# Altium schematic sheet CM3_HDMI.SchDoc
size A4; DocumentNumber: 2; SheetNumber: 2; SheetTotal: 4; SheetTitle: CM3_HDMI.SchDoc
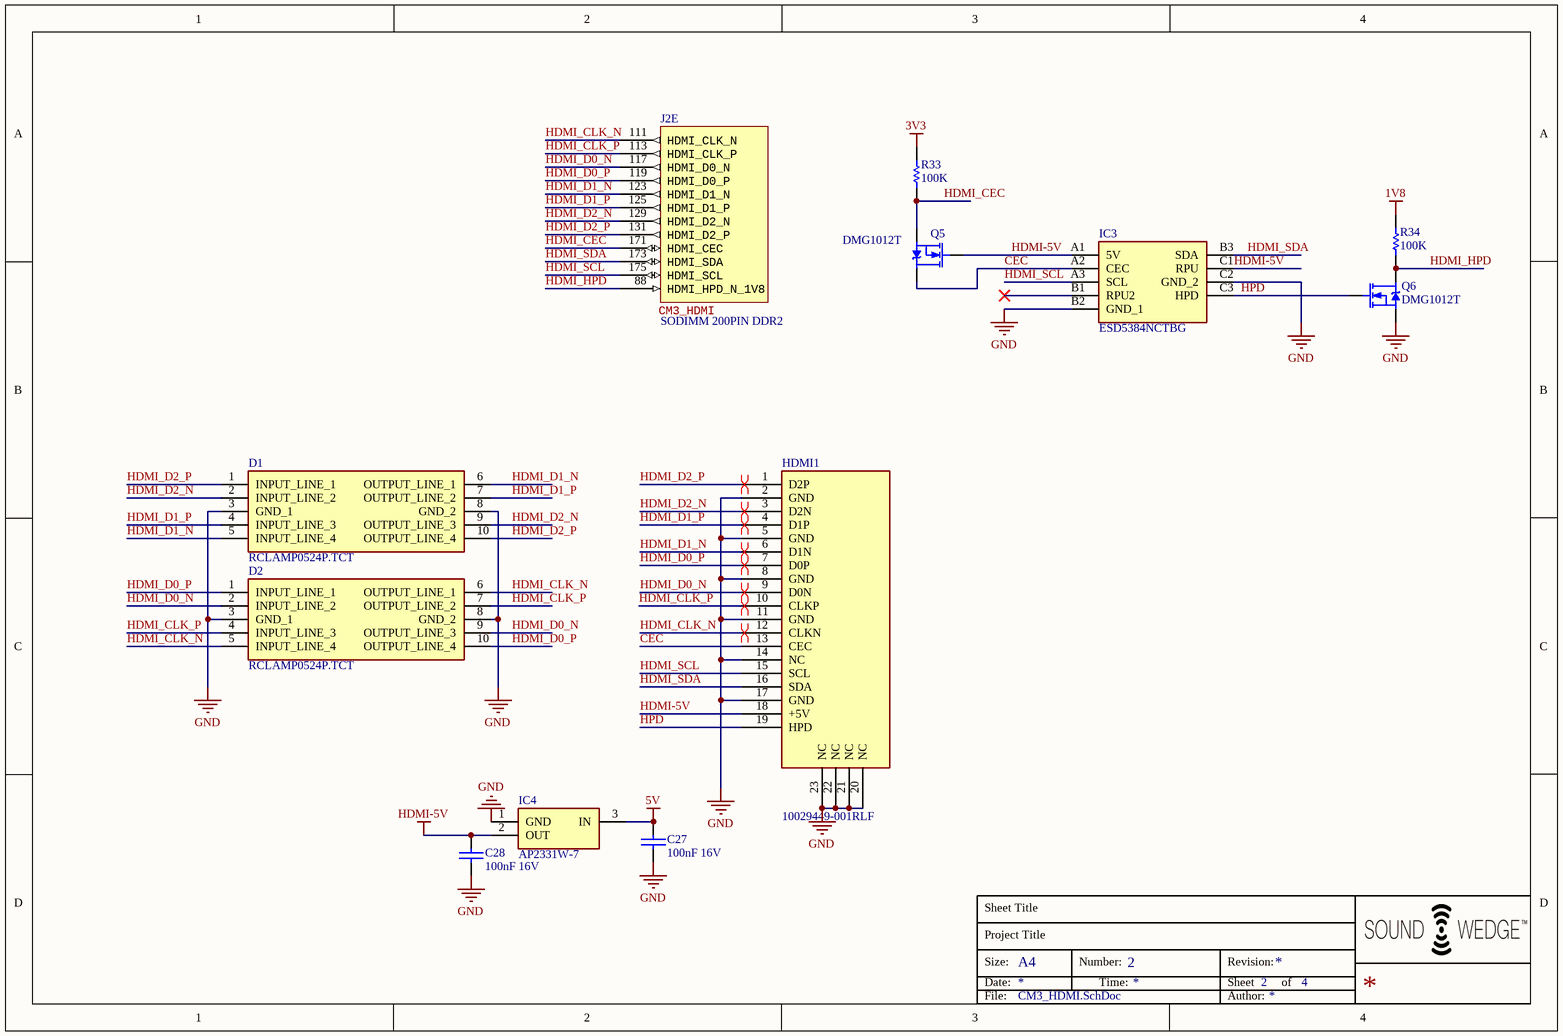
[diagram p0: CM3_HDMI.SchDoc]

## Parts
C27  100nF 16V  [0402C]
C28  100nF 16V  [0402C]
D1  RCLAMP0524P.TCT  [RCLAMP0524P]
D2  RCLAMP0524P.TCT  [RCLAMP0524P]
HDMI1  10029449-001RLF  [HDMI-001]
IC3  ESD5384NCTBG  [BGA9C40P3X3_114X114X63]
IC4  AP2331W-7  [SOT95P285X130-3N]
J2  SODIMM 200PIN DDR2  [SODIMM 200PIN - 5.2H]  (part E of 13)
Q5  DMG1012T  [SOT523]
Q6  DMG1012T  [SOT523]
R33  100K  [0402R]
R34  100K  [0402R]

## Nets
1V8: R34.2
3V3: R33.2
5V: C27.1 IC4.3(IN)
GND: C27.2 C28.2 D1.3(GND_1) D1.8(GND_2) D2.3(GND_1) D2.8(GND_2) HDMI1.2(GND) HDMI1.5(GND) HDMI1.8(GND) HDMI1.11(GND) HDMI1.14(NC) HDMI1.17(GND) HDMI1.20(NC) HDMI1.21(NC) HDMI1.22(NC) HDMI1.23(NC) IC3.B2(GND_1) IC3.C2(GND_2) IC4.1(GND) Q6.S
HDMI-5V: C28.1 HDMI1.18(+5V) IC3.A1(5V) IC3.C1(RPU) IC4.2(OUT) Q5.G
CEC: HDMI1.13(CEC) IC3.A2(CEC) Q5.D
HDMI_CEC: J2.171(HDMI_CEC) Q5.S R33.1
HDMI_CLK_N: D2.5(INPUT_LINE_4) D2.6(OUTPUT_LINE_1) HDMI1.12(CLKN) J2.111(HDMI_CLK_N)
HDMI_CLK_P: D2.4(INPUT_LINE_3) D2.7(OUTPUT_LINE_2) HDMI1.10(CLKP) J2.113(HDMI_CLK_P)
HDMI_D0_N: D2.2(INPUT_LINE_2) D2.9(OUTPUT_LINE_3) HDMI1.9(D0N) J2.117(HDMI_D0_N)
HDMI_D0_P: D2.1(INPUT_LINE_1) D2.10(OUTPUT_LINE_4) HDMI1.7(D0P) J2.119(HDMI_D0_P)
HDMI_D1_N: D1.5(INPUT_LINE_4) D1.6(OUTPUT_LINE_1) HDMI1.6(D1N) J2.123(HDMI_D1_N)
HDMI_D1_P: D1.4(INPUT_LINE_3) D1.7(OUTPUT_LINE_2) HDMI1.4(D1P) J2.125(HDMI_D1_P)
HDMI_D2_N: D1.2(INPUT_LINE_2) D1.9(OUTPUT_LINE_3) HDMI1.3(D2N) J2.129(HDMI_D2_N)
HDMI_D2_P: D1.1(INPUT_LINE_1) D1.10(OUTPUT_LINE_4) HDMI1.1(D2P) J2.131(HDMI_D2_P)
HDMI_HPD: J2.88(HDMI_HPD_N_1V8) Q6.D R34.1
HDMI_SCL: HDMI1.15(SCL) IC3.A3(SCL) J2.175(HDMI_SCL)
HDMI_SDA: HDMI1.16(SDA) IC3.B3(SDA) J2.173(HDMI_SDA)
HPD: HDMI1.19(HPD) IC3.C3(HPD) Q6.G

Not connected (* = marked no-connect by the designer): IC3 B1(RPU2)*

## Layout directives
differential pair: HDMI_CLK_N, HDMI_CLK_P, HDMI_D0_N, HDMI_D0_P, HDMI_D1_N, HDMI_D1_P, HDMI_D2_N, HDMI_D2_P

## Notes on the sheet
- Sheet Title
- Project Title
- Size:
- Date:
- A4
- Number:
- Time:
- Revision:
- Sheet
- of
- File:
- Author:
- (in symbol RPi-CM3, part E) CM3_HDMI

## Library data of the parts
C27 C28 = CAP
D1 D2 = RCLAMP0524P.TCT: Diode; Manufacturer_Name: SEMTECH; Datasheet Link: http://www.semtech.com/images/datasheet/rclamp0522p_0524p.pdf; Manufacturer_Part_Number: RCLAMP0524P.TCT; Arrow Part Number: RCLAMP0524P.TCT; Arrow Price/Stock: https://www.arrow.com/en/products/rclamp0524p.tct/semtech; Mouser Part Number: 947-RCLAMP0524P.TCT; Mouser Price/Stock: https://www.mouser.co.uk/ProductDetail/Semtech/RCLAMP0524PTCT?qs=rBWM4%252BvDhIdgSxIzr%252B4z8Q%3D%3D
HDMI1 = 10029449-001RLF: HDMI Connector; Manufacturer_Name: Amphenol; Allied_Number: 70247646; Datasheet Link: https://cdn.amphenol-icc.com/media/wysiwyg/files/drawing/10029449.pdf; Height: 6.3mm; Manufacturer_Part_Number: 10029449-001RLF; Mouser Part Number: 649-10029449-001RLF; Mouser Price/Stock: https://www.mouser.com/Search/Refine.aspx?Keyword=649-10029449-001RLF; RS Part Number: 7710094; RS Price/Stock: http://uk.rs-online.com/web/p/products/7710094; Allied Price/Stock: https://www.alliedelec.com/amphenolicc-10029449-001rlf/70247646/
IC3 = ESD5384NCTBG: Integrated Circuit; Manufacturer_Name: ON Semiconductor; Allied_Number: 70466034; Datasheet Link: http://www.onsemi.com/pub/Collateral/ESD5384-D.PDF; Height: 0.63mm; Manufacturer_Part_Number: ESD5384NCTBG; Mouser Part Number: 863-ESD5384NCTBG; Mouser Price/Stock: https://www.mouser.com/Search/Refine.aspx?Keyword=863-ESD5384NCTBG; RS Part Number: 8010213P; RS Price/Stock: http://uk.rs-online.com/web/p/products/8010213P; Allied Price/Stock: http://www.alliedelec.com/on-semiconductor-esd5384nctbg/70466034/
IC4 = AP2331W-7: Integrated Circuit; Manufacturer_Name: Diodes Inc.; Datasheet Link: https://componentsearchengine.com/Datasheets/1/AP2331W-7.pdf; Height: 1.3mm; Manufacturer_Part_Number: AP2331W-7; Mouser Part Number: 621-AP2331W-7; Mouser Price/Stock: https://www.mouser.com/Search/Refine.aspx?Keyword=621-AP2331W-7; RS Part Number: 8287665P; RS Price/Stock: http://uk.rs-online.com/web/p/products/8287665P
J2 = RPi-CM3
Q5 Q6 = N-MOS: N沟道场效应管
R33 R34 = RES